# EAGLE design Temp Board 1.2 (2) (EAGLE 8.4.3)
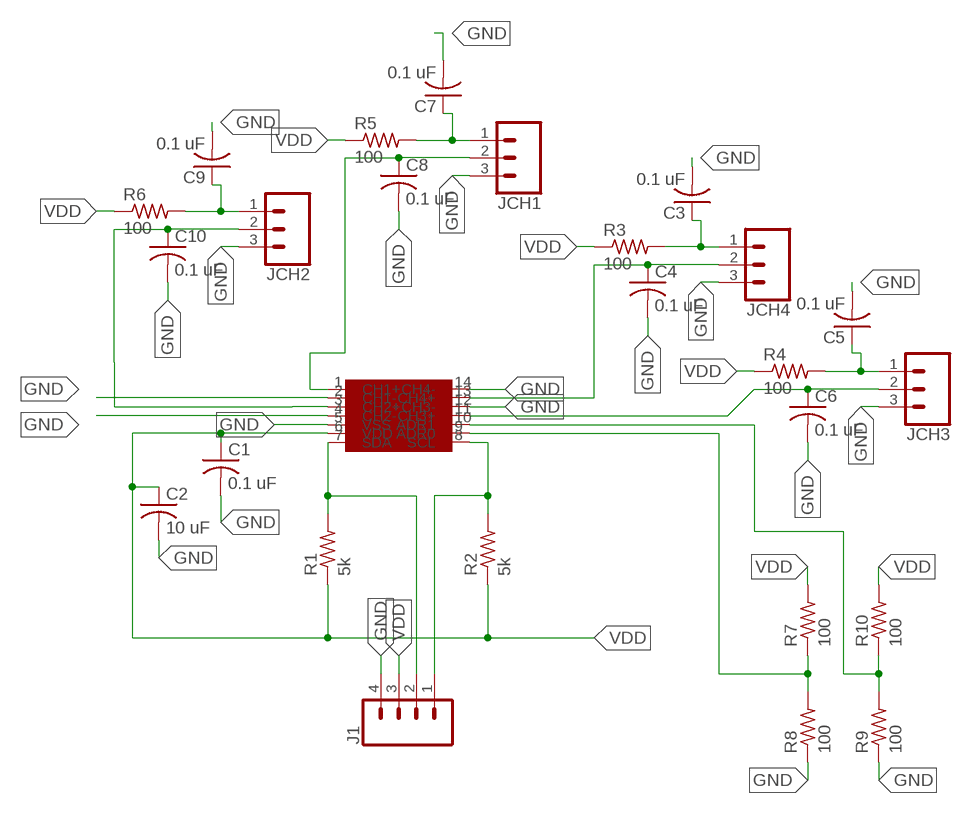
[diagram p0: schematic, sheet 1]

## Parts
C1  0.1 uF  C-USC0805  [C0805]
C2  10 uF  C-USC0805  [C0805]
C3  0.1 uF  C-USC0805  [C0805]
C4  0.1 uF  C-USC0805  [C0805]
C5  0.1 uF  C-USC0805  [C0805]
C6  0.1 uF  C-USC0805  [C0805]
C7  0.1 uF  C-USC0805  [C0805]
C8  0.1 uF  C-USC0805  [C0805]
C9  0.1 uF  C-USC0805  [C0805]
C10  0.1 uF  C-USC0805  [C0805]
J1  CONN_04LOCK_LONGPADS  [1X04_LOCK_LONGPADS]
JCH1  CONN_03LOCK_LONGPADS  [1X03_LOCK_LONGPADS]
JCH2  CONN_03LOCK_LONGPADS  [1X03_LOCK_LONGPADS]
JCH3  CONN_03LOCK_LONGPADS  [1X03_LOCK_LONGPADS]
JCH4  CONN_03LOCK_LONGPADS  [1X03_LOCK_LONGPADS]
R1  5k  R-US_M0805  [M0805]
R2  5k  R-US_M0805  [M0805]
R3  100  R-US_M0805  [M0805]
R4  100  R-US_M0805  [M0805]
R5  100  R-US_M0805  [M0805]
R6  100  R-US_M0805  [M0805]
R7  100  R-US_M0805  [M0805]
R8  100  R-US_M0805  [M0805]
R9  100  R-US_M0805  [M0805]
R10  100  R-US_M0805  [M0805]
U$1  MCP3428A  [C04-065B]

## Nets
GND: C1.2 C2.2 C3.2 C4.2 C5.2 C6.2 C7.2 C8.2 C9.2 C10.2 J1.4 JCH1.3 JCH2.3 JCH3.3 JCH4.3 R8.1 R9.1 U$1.2(CH1-) U$1.4(CH2-) U$1.5(VSS) U$1.12(CH3-) U$1.14(CH4-)
N$1: C3.1 JCH4.1 R3.2
N$2: C4.1 JCH4.2 U$1.13(CH4+)
N$4: C6.1 JCH3.2 U$1.11(CH3+)
N$5: C7.1 JCH1.1 R5.2
N$6: C8.1 JCH1.2 U$1.1(CH1+)
N$7: C9.1 JCH2.1 R6.2
N$8: C10.1 JCH2.2 U$1.3(CH2+)
N$9: R7.1 R8.2 U$1.9(ADR0)
N$10: J1.2 R1.2 U$1.7(SDA)
N$11: J1.1 R2.2 U$1.8(SCL)
N$12: R9.2 R10.1 U$1.10(ADR1)
N$13: C5.1 JCH3.1 R4.2
VDD: C1.1 C2.1 J1.3 R1.1 R2.1 R3.1 R4.1 R5.1 R6.1 R7.2 R10.2 U$1.6(VDD)

## Library data of the parts
C1-C10 = resistor:C-US: CAPACITOR, American symbol
J1 = SparkFun-Connectors:CONN_04: Multi connection point. Often used as Generic Header-pin footprint for 0.1 inch spaced/style header connections On any of the 0.1 inch spaced packages, you can populate with these: Break Away Headers - Straight <https://www.sparkfun.com/products/116> (PRT-00116) Break Away Male Headers - Right Angle <https://www.sparkfun.com/products/553> (PRT-00553) Female Headers <https://www.sparkfun.com/products/115> (PRT-00115) Break Away Headers - Machine Pin <https://www.sparkfun.com/products/117> (PRT-00117) Break Away Female Headers - Swiss Machine Pin <https://www.sparkfun.com/products/743> (PRT-00743) For SCREWTERMINALS and SPRING TERMINALS visit here: Screw Terimnals on SparkFun.com <https://www.sparkfun.com/search/results?term=Screw+Terminals> (5mm/3.5mm/2.54mm spacing) This device is also useful as a general connection point to wire up your design to another part of your project. Our various solder wires solder well into these plated through hole pads. Hook-Up Wire - Assortment (Stranded, 22 AWG) <https://www.sparkfun.com/products/11375> (PRT-11375) Hook-Up Wire - Assortment (Solid Core, 22 AWG) <https://www.sparkfun.com/products/11367> (PRT-11367) View the entire wire category on our website here <https://www.sparkfun.com/categories/141> Special notes: Molex polarized connector foot print use with SKU : PRT-08231 with associated crimp pins and housings. 1MM SMD Version SKU: PRT-10208; PROD_ID: CONN-09696
JCH1-JCH4 = SparkFun-Connectors:CONN_03: Multi connection point. Often used as Generic Header-pin footprint for 0.1 inch spaced/style header connections On any of the 0.1 inch spaced packages, you can populate with these: Break Away Headers - Straight <https://www.sparkfun.com/products/116> (PRT-00116) Break Away Male Headers - Right Angle <https://www.sparkfun.com/products/553> (PRT-00553) Female Headers <https://www.sparkfun.com/products/115> (PRT-00115) Break Away Headers - Machine Pin <https://www.sparkfun.com/products/117> (PRT-00117) Break Away Female Headers - Swiss Machine Pin <https://www.sparkfun.com/products/743> (PRT-00743) Stackable Header - 3 Pin (Female, 0.1") <https://www.sparkfun.com/products/13875> (PRT-13875) For SCREWTERMINALS and SPRING TERMINALS visit here: Screw Terimnals on SparkFun.com <https://www.sparkfun.com/search/results?term=Screw+Terminals> (5mm/3.5mm/2.54mm spacing) This device is also useful as a general connection point to wire up your design to another part of your project. Our various solder wires solder well into these plated through hole pads. Hook-Up Wire - Assortment (Stranded, 22 AWG) <https://www.sparkfun.com/products/11375> (PRT-11375) Hook-Up Wire - Assortment (Solid Core, 22 AWG) <https://www.sparkfun.com/products/11367> (PRT-11367) View the entire wire category on our website here <https://www.sparkfun.com/categories/141> Special notes: Molex polarized connector foot print use with SKU : PRT-08232 with associated crimp pins and housings.
R1-R10 = rcl:R-US_: RESISTOR, American symbol
U$1 = Temperature:MCP3428

## Net classes
0 default: width 0.305 mm, drill 0.508 mm, clearance 0.254 mm

## Board
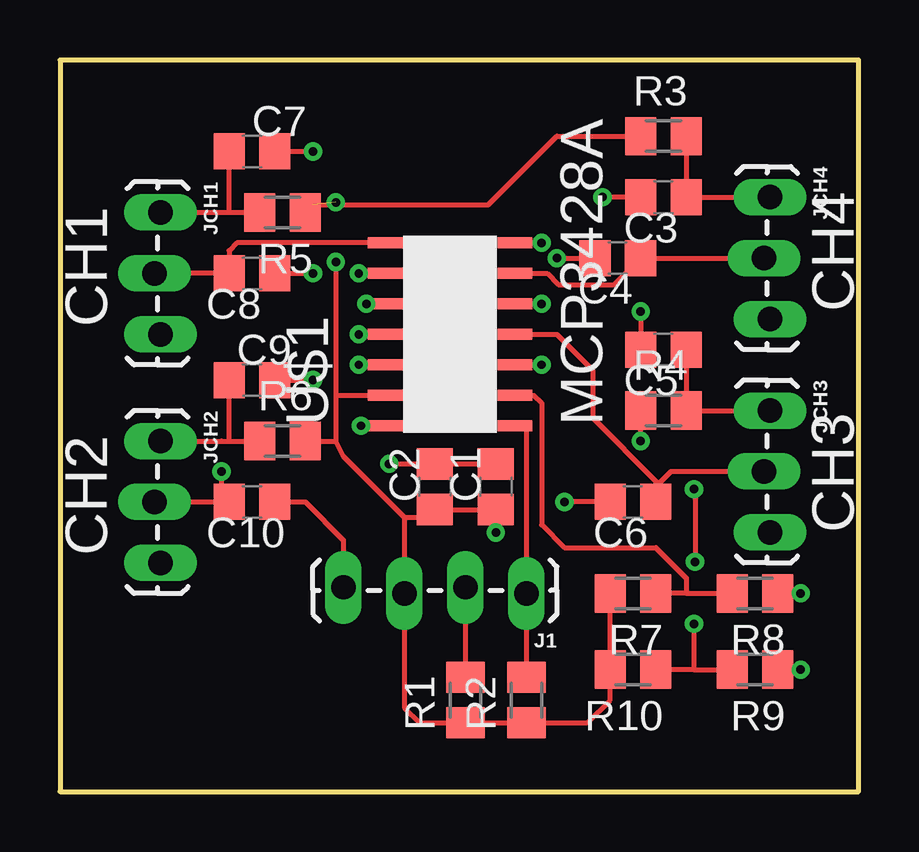
[diagram p1: board, top side]
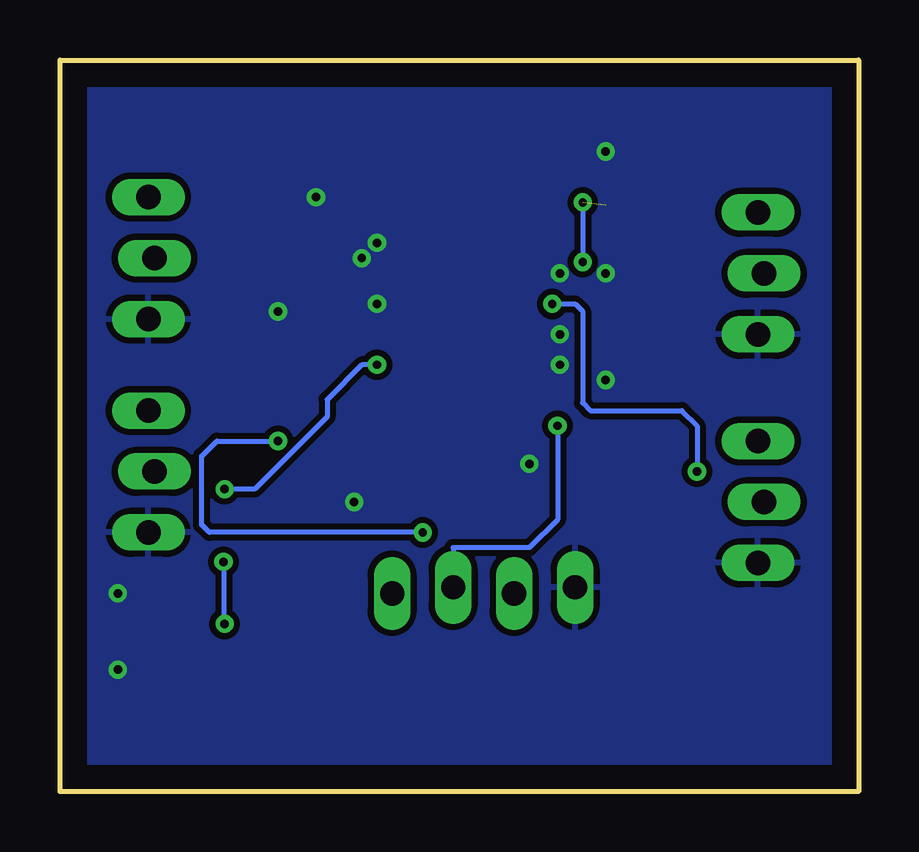
[diagram p2: board, bottom side, seen from below]

Size 33.27 x 30.48 mm. Coordinates in mm from the lower left corner, seen from the top.
Outline: 0,30.48 0,0 33.27,0 33.27,30.48 0,30.48
Copper layers (1*16): Top 0.035mm / dielectric 1.5mm / Bottom 0.035mm
Design rules "default": minimum track width 6mil, minimum drill 0.35mm, track to track 6mil, track to pad 6mil, pad to pad 6mil, via to via 6mil, smd to smd 6mil, copper to edge 40mil, drill to drill 6mil, minimum pad ring 10mil, minimum via ring 8mil, stop-mask expansion 4mil, vias tented up to drill 0mil, thermal gap 10mil

### Footprints (pad centres in the part's own frame; a part is rotated, then mirrored left to right if it is on the bottom)
C0805 = smd 1.3 x 1.5: 1 -0.95,0; 2 0.95,0
1X04_LOCK_LONGPADS = drill 1.016 long: 1 0,0; 2 2.54,-0.254; 3 5.08,0; 4 7.62,-0.254
1X03_LOCK_LONGPADS = drill 1.016 long: 1 0,0; 2 2.54,-0.254; 3 5.08,0
M0805 = smd 1.3 x 1.6: 1 -0.95,0; 2 0.95,0
C04-065B = smd 0.45 x 1.45: 1 3.81,2.7; 2 2.54,2.7; 3 1.27,2.7; 4 0,2.7; 5 -1.27,2.7; 6 -2.54,2.7; 7 -3.81,2.7; 8 -3.81,-2.7; 9 -2.54,-2.7; 10 -1.27,-2.7; 11 0,-2.7; 12 1.27,-2.7; 13 2.54,-2.7; 14 3.81,-2.7

### Placement (x,y rotation side)
C1  18.16,12.7 90 top
C2  15.62,12.7 90 top
C3  25.15,24.76 180 top
C4  23.24,22.22 180 top
C5  25.15,18.41 180 top
C6  23.88,12.07 180 top
C7  8,26.67 0 top
C8  8,21.59 0 top
C9  8,17.14 0 top
C10  8,12.07 0 top
J1  19.43,8.25 180 top
JCH1  4.19,24.13 270 top
JCH2  4.19,14.61 270 top
JCH3  29.59,15.88 270 top
JCH4  29.59,24.76 270 top
R1  16.89,3.81 90 top
R2  19.43,3.81 90 top
R3  25.15,27.31 0 top
R4  25.15,15.88 0 top
R5  9.27,24.13 180 top
R6  9.27,14.61 180 top
R7  23.88,8.25 180 top
R8  28.96,8.25 180 top
R9  28.96,5.08 180 top
R10  23.88,5.08 180 top
U$1  16.26,19.05 90 top

### Tracks (layer width: path | path; a pad name or v marks a point on that pad's centre or on a via)
GND  (via drill 0.35)
  Top 0.152: v20.07,20.32 U$1.12
  Top 0.203: C3.2 v22.61,24.76 | v24.19,20 C5.2 | v12.45,17.78 U$1.5 | v12.45,21.59 U$1.2 | R8.1 v30.86,8.25 | R9.1 v30.86,5.08 | v12.45,19.05 U$1.4 | C7.2 v10.54,26.67 | C8.2 v10.54,21.59 | C9.2 v10.54,17.14 | v13.72,13.65 C2.2 C1.2 | C6.2 v21.02,12.07 | C10.2 10.22,12.07 11.81,10.48 J1.4 | v20.7,22.22 C4.2 | v20.07,22.86 U$1.14
  pour Bottom: 0,30.48 33.27,30.48 33.27,0 0,0
N$1
  Top 0.203: R3.2 C3.1 JCH4.1
N$2
  Top 0.203: C4.1 | C4.1 JCH4.2 | 23.3,21.33 23.09,21.12 20.77,21.12 20.3,21.59 U$1.13 | 23.3,21.33 | 23.3,21.33 C4.1
N$4
  Top 0.203: U$1.11 | 24.83,12.7 25.46,13.34 JCH3.2 | 24.83,12.7 C6.1 | U$1.11 20.7,19.05 22.19,17.56 22.19,15.57 24.83,12.93 24.83,12.7
N$5
  Top 0.203: JCH1.1 6.73,24.13 | 6.73,24.13 7.05,24.13 C7.1 | 6.73,24.13 R5.2
N$6
  Top 0.203: JCH1.2 C8.1 7.05,22.54 7.37,22.86 U$1.1
N$7
  Top 0.203: JCH2.1 6.73,14.61 | 6.73,14.61 7.05,14.61 C9.1 | 6.73,14.61 R6.2
N$8  (via drill 0.35)
  Top 0.203: JCH2.2 C10.1 6.73,12.07 v6.73,13.34 | v12.76,20.32 U$1.3
  Bottom 0.203: v12.76,20.32 11.81,20.32 11.49,20 11.49,16.19 11.18,15.88 7.37,15.88 6.73,15.24 v6.73,13.34
N$9
  Top 0.203: 26.1,8.25 R7.1 | 26.1,8.25 R8.2 | 26.1,8.25 26.1,8.89 24.83,10.16 21.02,10.16 20.07,11.11 20.07,16.19 19.75,16.51 U$1.9
N$10  (via drill 0.35)
  Top 0.203: U$1.7 v12.54,15.24 | J1.2 R1.2
  Bottom 0.203: J1.2 16.89,10.16 13.72,10.16 12.54,11.33 v12.54,15.24
N$11
  Top 0.203: U$1.8 19.43,15.24 J1.1 R2.2
N$12  (via drill 0.35)
  Top 0.203: 26.42,5.08 R10.1 | 26.42,5.08 R9.2 | U$1.10 v20.07,17.78 | v26.42,6.98 26.42,5.08 | v26.42,12.6 26.46,12.56 v26.46,9.57
  Bottom 0.203: v20.07,17.78 20.7,17.78 22.15,16.33 22.15,15.61 25.16,12.6 v26.42,12.6 | v26.46,9.57 26.46,7.03 v26.42,6.98
N$13
  Top 0.203: C5.1 R4.2 JCH3.1
VDD  (via drill 0.35)  (1 unrouted)
  Top 0.203: R7.2 R10.2 22.93,3.81 21.97,2.86 R2.1 R1.1 14.99,2.86 14.35,3.49 J1.3 14.35,11.43 | R6.1 11.49,14.61 | 11.49,16.51 U$1.6 | 11.49,16.51 11.49,14.61 | v11.49,22.07 11.49,16.51 | v18.16,10.79 C1.1 C2.1 15.62,11.43 14.35,11.43 | R5.1 10.54,24.45 17.84,24.45 20.7,27.31 R3.1 | 11.49,14.61 11.81,13.97 14.35,11.43 | v24.19,14.61 v24.2,14.61 R4.1
  Bottom 0.203: v11.49,24.55 v11.49,22.07 | v18.16,10.79 27.05,10.79 27.37,11.11 27.37,13.97 26.73,14.61 v24.19,14.61

### Text on the board
tSilk: CH1 | CH4 | CH3 | CH2